# EAGLE design PCG (EAGLE 9.6.2)
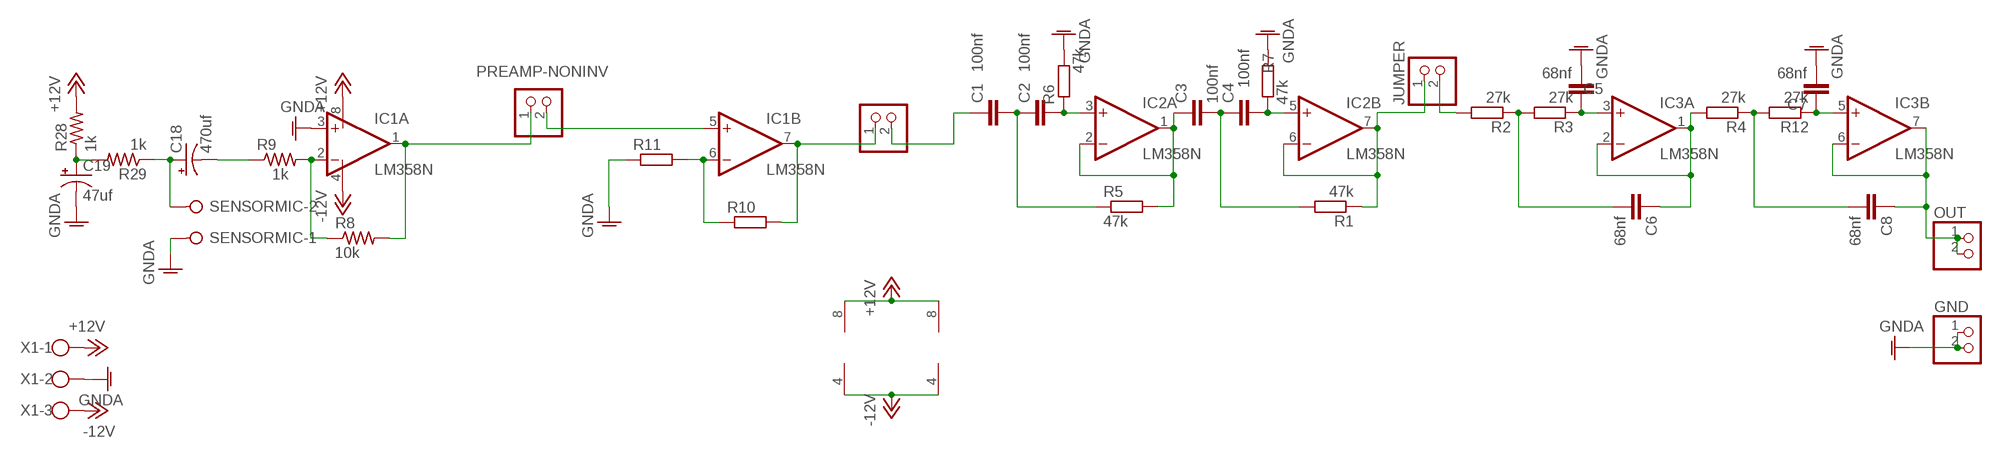
[diagram p0: schematic, sheet 1]

## Parts
C1  100nf  C-EU050-025X075  [C050-025X075]
C2  100nf  C-EU050-025X075  [C050-025X075]
C3  100nf  C-EU050-025X075  [C050-025X075]
C4  100nf  C-EU050-025X075  [C050-025X075]
C5  68nf  C-EU050-025X075  [C050-025X075]
C6  68nf  C-EU050-025X075  [C050-025X075]
C7  68nf  C-EU050-025X075  [C050-025X075]
C8  68nf  C-EU050-025X075  [C050-025X075]
C18  470uf  CPOL-USE2.5-7  [E2,5-7]
C19  47uf  CPOL-USE2-5  [E2-5]
GND  PINHD-1X2  [1X02]
IC1  LM358N  [DIL08]
IC2  LM358N  [DIL08]
IC3  LM358N  [DIL08]
JUMPER  PINHD-1X2  [1X02]
NONINV-BPF  PINHD-1X2  [1X02]
OUT  PINHD-1X2  [1X02]
PREAMP-NONINV  PINHD-1X2  [1X02]
R1  47k  R-EU_0207/10  [0207/10]
R2  27k  R-EU_0207/10  [0207/10]
R3  27k  R-EU_0207/10  [0207/10]
R4  27k  R-EU_0207/10  [0207/10]
R5  47k  R-EU_0207/10  [0207/10]
R6  47k  R-EU_0207/10  [0207/10]
R7  47k  R-EU_0207/10  [0207/10]
R8  10k  R-US_0207/7  [0207/7]
R9  1k  R-US_0207/7  [0207/7]
R10  R-EU_0207/10  [0207/10]
R11  R-EU_0207/10  [0207/10]
R12  27k  R-EU_0207/10  [0207/10]
R28  1k  R-US_0207/7  [0207/7]
R29  1k  R-US_0207/7  [0207/7]
SENSORMIC  W237-02P  [W237-132]
X1  W237-103  [W237-103]

## Nets
+12V: IC1.8(P:V+) IC2.8(P:V+) IC3.8(P:V+) R28.2 X1.1
-12V: IC1.4(P:V-) IC2.4(P:V-) IC3.4(P:V-) X1.3
GNDA: C5.2 C7.2 C19.- GND.1 GND.2 IC1.3(A:+IN) R6.2 R7.2 R11.1 SENSORMIC.1 X1.2
N$1: C2.2 IC2.3(A:+IN) R6.1
N$2: C7.1 IC3.5(B:+IN) R12.1
N$3: C8.1 IC3.6(B:-IN) IC3.7(B:OUT) OUT.1 OUT.2
N$5: JUMPER.2 R2.2
N$7: C1.2 C2.1 R5.1
N$8: C1.1 NONINV-BPF.2
N$9: C3.1 IC2.1(A:OUT) IC2.2(A:-IN) R5.2
N$10: C3.2 C4.1 R1.2
N$11: C4.2 IC2.5(B:+IN) R7.1
N$12: IC2.6(B:-IN) IC2.7(B:OUT) JUMPER.1 R1.1
N$13: C6.2 R2.1 R3.2
N$14: C5.1 IC3.3(A:+IN) R3.1
N$15: C6.1 IC3.1(A:OUT) IC3.2(A:-IN) R4.2
N$16: C8.2 R4.1 R12.2
N$17: IC1.2(A:-IN) R8.1 R9.2
N$18: IC1.1(A:OUT) PREAMP-NONINV.1 R8.2
N$19: C18.- R9.1
N$20: IC1.6(B:-IN) R10.1 R11.2
N$21: IC1.7(B:OUT) NONINV-BPF.1 R10.2
N$22: IC1.5(B:+IN) PREAMP-NONINV.2
N$39: C19.+ R28.1 R29.2
STETOSKOP1: C18.+ R29.1 SENSORMIC.2

## Library data of the parts
C1-C8 = rcl:C-EU: CAPACITOR, European symbol; SPICEPREFIX: C
C18 C19 = rcl:CPOL-US: POLARIZED CAPACITOR, American symbol; SPICEPREFIX: C
GND JUMPER NONINV-BPF OUT PREAMP-NONINV = pinhead:PINHD-1X2: PIN HEADER
IC1-IC3 = linear:LM358: OP AMP also LM158; LM258; LM2904 Source: http://cache.national.com/ds/LM/LM158.pdf
R1-R7 R10-R12 = rcl:R-EU_: RESISTOR, European symbol; SPICEPREFIX: R
R8 R9 R28 R29 = rcl:R-US_: RESISTOR, American symbol; SPICEPREFIX: R
SENSORMIC = con-wago-508:W237-02P: WAGO SREW CLAMP; OC_FARNELL: unknown; OC_NEWARK: unknown
X1 = con-wago-500:W237-103: WAGO SCREW CLAMP; MPN: 237-103; OC_FARNELL: unknown; OC_NEWARK: 18M7116

## Board
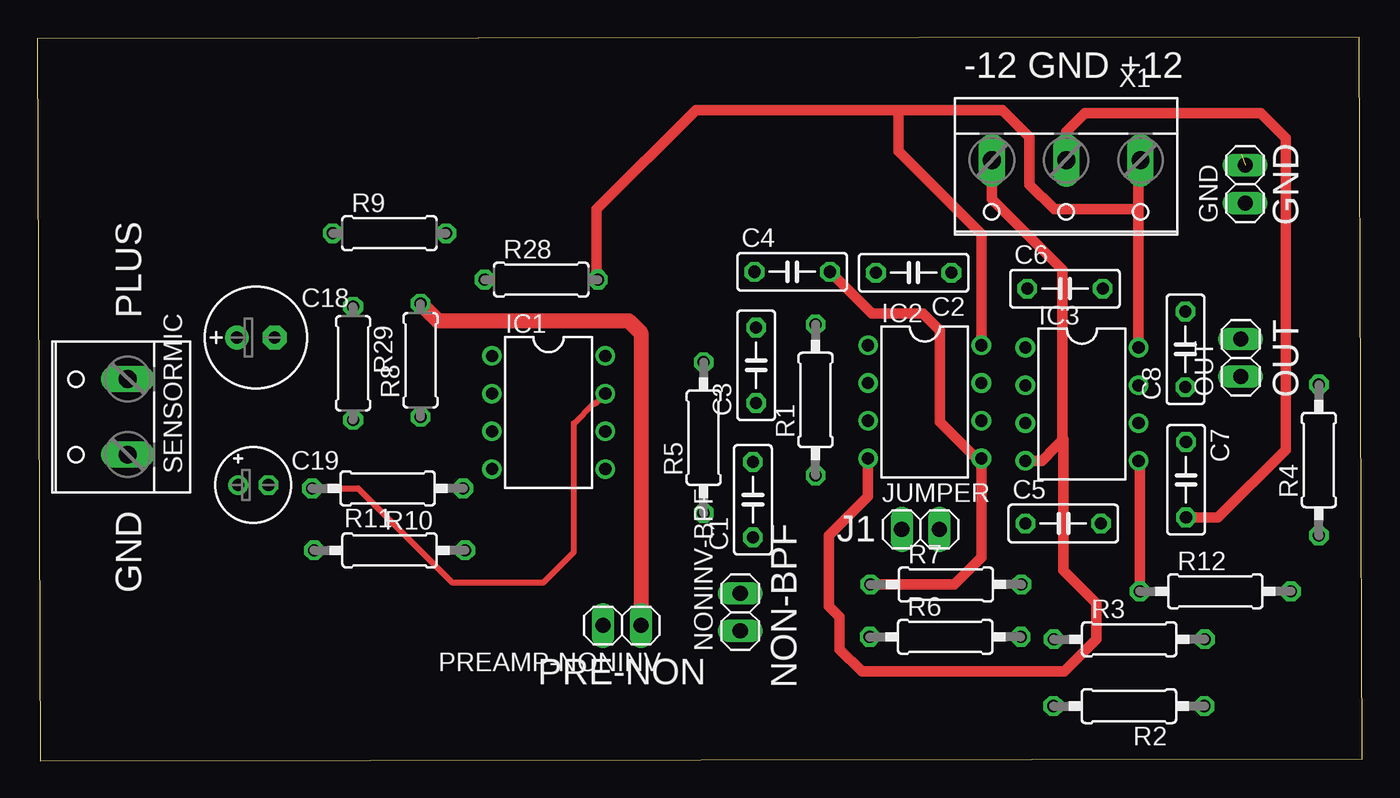
[diagram p1: board, top side]
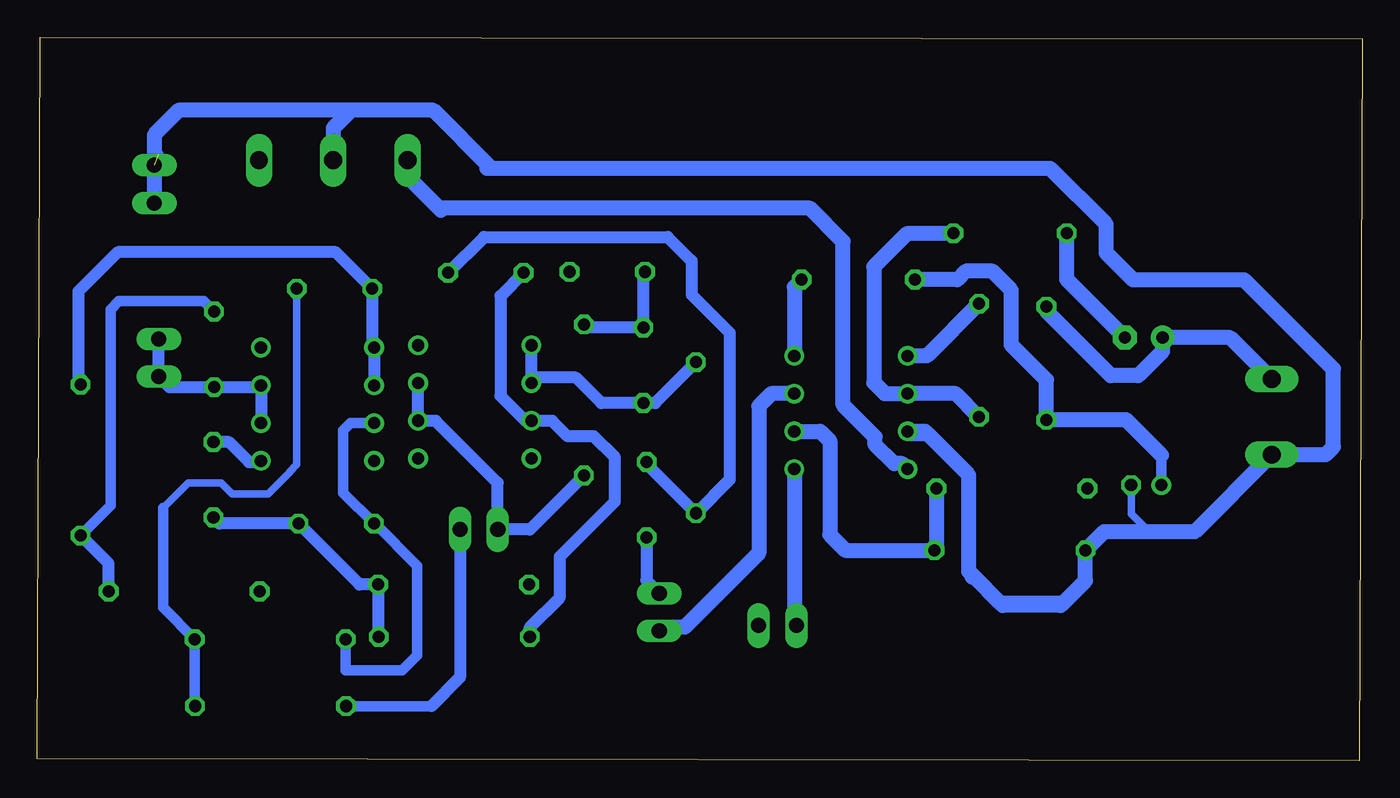
[diagram p2: board, bottom side, seen from below]

Size 89.16 x 48.68 mm. Coordinates in mm from the lower left corner, seen from the top.
Outline: 0.22,0 89.16,0.11 88.94,48.68 0,48.57 0.22,0
Copper layers (1*16): Top 0.035mm / dielectric 1.5mm / Bottom 0.035mm
Design rules "default *": minimum track width 6mil, minimum drill 0.35mm, track to track 40mil, track to pad 40mil, pad to pad 6mil, via to via 6mil, smd to smd 6mil, copper to edge 40mil, drill to drill 6mil, minimum pad ring 10mil, minimum via ring 8mil, stop-mask expansion 4mil, vias tented up to drill 0mil, thermal gap 10mil

### Footprints (pad centres in the part's own frame; a part is rotated, then mirrored left to right if it is on the bottom)
C050-025X075 = drill 0.813 octagon: 1 -2.54,0; 2 2.54,0
E2,5-7 = drill 0.813 pad 1.6: + -1.27,0 | drill 0.813 pad 1.6 octagon: - 1.27,0
E2-5 = drill 0.813 pad 1.27: + -1.016,0 | drill 0.813 pad 1.27 octagon: - 1.016,0
1X02 = drill 1.016 long: 1 -1.27,0; 2 1.27,0
DIL08 = drill 0.813 pad 1.27: 1 -3.81,-3.81; 2 -1.27,-3.81; 3 1.27,-3.81; 4 3.81,-3.81; 5 3.81,3.81; 6 1.27,3.81; 7 -1.27,3.81; 8 -3.81,3.81
0207/10 = drill 0.813 octagon: 1 -5.08,0; 2 5.08,0
0207/7 = drill 0.813 octagon: 1 -3.81,0; 2 3.81,0
W237-132 = drill 1.194 long: 1 -2.54,-0.635; 2 2.54,-0.635
W237-103 = drill 1.194 long: 1 -5,-1.29; 2 0,-1.29; 3 5,-1.29

### Placement (x,y rotation side)
C1  48.15,17.55 90 top
C2  58.97,32.83 180 top
C3  48.37,26.6 90 top
C4  50.8,32.89 0 top
C5  69.03,15.95 0 top
C6  69.15,31.75 0 top
C7  77.3,18.9 270 top
C8  77.26,27.67 90 top
C18  14.71,28.47 0 top
C19  14.54,18.54 0 top
GND  81.27,38.79 90 top
IC1  34.41,23.42 270 top
IC2  59.71,24.14 270 top
IC3  70.29,23.98 270 top
JUMPER  59.43,15.55 0 top
NONINV-BPF  47.3,9.99 90 top
OUT  80.97,27.1 90 top
PREAMP-NONINV  39.35,9.09 180 top
R1  52.37,24.27 90 top
R2  73.45,3.67 180 top
R3  73.47,8.16 0 top
R4  86.23,20.22 90 top
R5  44.84,21.73 90 top
R6  61.09,8.32 0 top
R7  61.14,11.84 0 top
R8  25.79,26.94 90 top
R9  23.7,35.49 0 top
R10  23.58,18.31 180 top
R11  23.71,14.15 0 top
R12  79.26,11.39 0 top
R28  33.91,32.37 0 top
R29  21.26,26.73 270 top
SENSORMIC  5.46,23.13 90 top
X1  69.24,39.11 180 top

### Tracks (layer width: path | path; a pad name or v marks a point on that pad's centre or on a via)
+12V
  Top 0.7: IC3.8 74.1,37.1 | 74.1,37.1 74.1,40.27 X1.1 | R28.2 37.65,32.44 37.65,37.11 44.32,43.78 57.96,43.78 | 57.96,43.78 64.94,43.78 66.77,41.96 66.77,38.77 68.45,37.1 74.1,37.1 | IC2.8 63.52,31.98 63.53,31.99 63.53,35.42 57.96,40.99 57.96,43.78
  Bottom 1: R28.2 38.22,31.87 IC1.8
-12V
  Top 0.7: X1.3 64.23,37.79 68.99,33.04 68.99,21.56 | 68.99,21.56 68.55,21.12 67.6,20.17 IC3.4 | 68.99,21.56 69.06,21.63 69.06,12.79 71.26,10.59 71.26,8.17 69.09,6 55.47,6 53.99,7.48 53.99,9.65 53.28,10.36 53.28,15.16 55.9,17.78 IC2.4
  Bottom 1: X1.3 64.23,39.3 62.1,37.16 | 62.1,37.16 61.98,37.04 | IC1.4 30.96,19.98 31.5,19.98 32.78,21.25 32.78,21.79 34.93,23.94 34.93,34.93 37.16,37.16 62.1,37.16
GNDA  (1 unrouted)
  Top 0.7: X1.2 69.23,42.32 70.47,43.56 82.31,43.56 83.99,41.87 83.99,20.91 79.44,16.36 C7.2
  Bottom 0.5: 14.34,15.4 11.28,15.4 | C19.- 15.55,16.61 14.34,15.4 | 14.34,15.4 17.38,15.4
  Bottom 0.7: GND.1 81.27,40.55 | 81.27,40.55 81.01,40.81 | 81.27,40.55 81.27,41.83
  Bottom 0.8: C7.2 76.89,15.95 C5.2 67.47,11.85 R7.2 66.22,8.37 R6.2
  Bottom 1: 29.26,21.99 30.44,21.99 IC1.3 29.42,22.15 29.26,21.99 | 20.11,10.62 18.63,12.1 R11.1 17.38,15.4 11.28,15.4 SENSORMIC.1 2.47,20.59 1.96,21.11 1.96,26.35 7.95,32.35 15.42,32.35 17.24,34.16 17.24,36.09 20.99,39.84 58.58,39.84 | 24.38,10.62 20.11,10.62 | 26.11,12.36 26.23,12.36 | 20.11,10.62 20.29,10.44 24.2,10.44 24.38,10.62 | 58.58,39.84 58.92,39.84 | 58.58,39.84 62.49,43.75 68.04,43.75 | 68.04,43.75 69.23,42.56 X1.2 | 68.04,43.75 79.63,43.75 81.27,42.12 81.27,41.83 GND.1 | 24.38,10.62 26.11,12.36 | 26.11,12.36 26.48,12.73 26.48,19.21 29.26,21.99
N$1
  Bottom 0.8: R6.1 56.01,8.95 53.98,10.98 53.98,13.73 50.29,17.42 50.29,20.41 51.71,21.83 53.47,21.83 54.51,22.87 IC2.3 56.3,22.87 57.98,24.55 57.98,31.27 C2.2
N$2
  Top 0.7: R12.1 74.18,20.09 IC3.5
  Bottom 0.8: IC3.5 74.19,20.09 74.9,20.09 76.25,21.44 C7.1
N$3
  Bottom 0.8: OUT.2 OUT.1 80.27,25.13 C8.1 74.22,25.13 IC3.7 IC3.6
N$5
  Bottom 0.7: R2.2 62.63,3.67
  Bottom 0.8: JUMPER.2 60.72,15.54 60.72,5.58 62.63,3.67
N$7
  Bottom 0.8: C1.2 48.15,19.96 R5.1 42.57,18.91 42.57,28.8 45.12,31.35 45.12,33.63 46.73,35.23 59.1,35.23 C2.1
N$8
  Bottom 0.8: C1.1 48.17,15 48.17,12.13 NONINV-BPF.2
  Bottom 1: 47.11,11.45 NONINV-BPF.2
N$9
  Bottom 0.8: R5.2 47.58,24.06 C3.1 51.19,24.06 52.9,25.77 55.54,25.77 IC2.2 IC2.1
N$10
  Bottom 0.8: C4.1 48.37,32.77 C3.2 52.16,29.14 R1.2
N$11
  Top 0.7: R7.1 61.71,11.85 63.52,13.66 IC2.5 63.2,20.33 60.75,22.77 60.75,28.93 59.6,30.08 56.15,30.08 C4.2
N$12
  Bottom 0.8: R1.1 56,15.55 JUMPER.1 58.16,18.69 62.34,22.87 IC2.6 IC2.7
N$13
  Bottom 0.5: C6.2 71.69,19.92 72.17,19.43 72.17,19.37 73.62,17.93 76.03,17.93 76.78,18.68 79.01,18.68 80.69,17
  Bottom 0.7: 80.69,17 80.69,10.3 R3.2 78.55,3.69 R2.1
N$14
  Bottom 0.7: R3.1 68.39,6.08 64.6,6.08 63.59,7.09 63.59,13.11 66.43,15.95 C5.1 68.56,18.02 68.56,22.21 68.05,22.72 | IC3.3 68.04,22.71 68.05,22.72 | 68.05,22.72
N$15
  Bottom 0.8: IC3.2 IC3.1 66.61,27.92 C6.1 69.07,34.21 83.73,34.21 86.38,31.57 86.38,25.45 R4.2
N$16
  Bottom 0.7: C8.2 77.97,30.92 83.66,30.92 84.22,30.36 84.22,26.16 84.21,26.14 84.21,17.17 R4.1
  Bottom 0.8: R12.2 84.34,13.26 R4.1
N$17
  Bottom 1: R9.2 27.54,35.46 30.64,35.46 32.87,33.23 32.87,25.43 32.13,24.69 IC1.2 27.35,24.69 R8.1
N$18
  Top 1: R8.2 26.93,29.61 39.79,29.61 40.62,28.78 PREAMP-NONINV.1
  Bottom 1: R8.2 29.3,27.23 IC1.1
N$19
  Bottom 1: C18.- 19.89,32.37 R9.1
N$20
  Bottom 1: R10.1 28.66,14.27 R11.2 | R11.2 | IC1.6 36.46,22.15 35.83,21.52 35.83,15.2 34.78,14.15 R11.2
N$21
  Top 0.4: R10.2 21.59,18.31 27.92,11.99 34.06,11.99 36.11,14.04 36.11,22.7 37.44,24.03 37.56,24.03 IC1.7
  Bottom 1: R10.2 | IC1.7 39.76,24.69 40.61,23.84 40.61,13.96 45.59,8.98 47.04,8.98 NONINV-BPF.1
N$22
  Bottom 1: IC1.5 38.22,9.23 PREAMP-NONINV.2
N$39
  Bottom 0.7: C19.+ 13.52,20.56
  Bottom 1: 13.52,20.56 15.88,22.92 R29.2 21.26,25.62 23.61,27.98 23.61,31.65 24.89,32.93 26.69,32.93 27.25,32.37 R28.1
STETOSKOP1
  Bottom 1: SENSORMIC.2 8.89,28.47 C18.+ 13.44,27.53 15.07,25.9 16.93,25.9 21.26,30.23 R29.1

### Text on the board
tPlace: -12 GND +12 | GND | PLUS | OUT | J1 | GND | PRE-NON | NON-BPF
tValues: GND | +12V | -12V